# Altium schematic sheet UART_AVR.SchDoc: MCU UART Module
size A4; Author: Nikola Rašević; Organization: Memristor Robotics
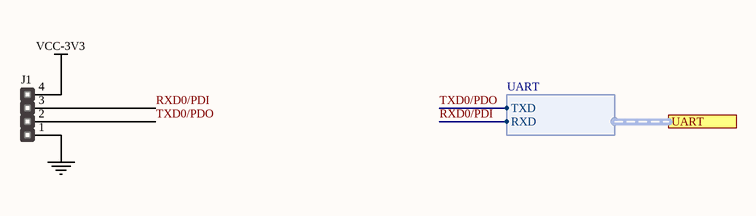
[diagram p0: UART_AVR.SchDoc]

## Parts
J1  HEADER_1x4  [HM1X4]  (value not drawn)

## Ports
UART (harness UART)

## Harnesses
UART: TXD, RXD

## Nets
GND: J1.1
VCC-3V3: J1.4
RXD0/PDI: J1.3 ; port UART.RXD
TXD0/PDO: J1.2 ; port UART.TXD

## Notes on the sheet
- Title
- Date:
- Design Engineer:
- Time:
- Revision:
- Sheet
- of
- Size:
- A4
- www.memristor-robotics.io
- File: